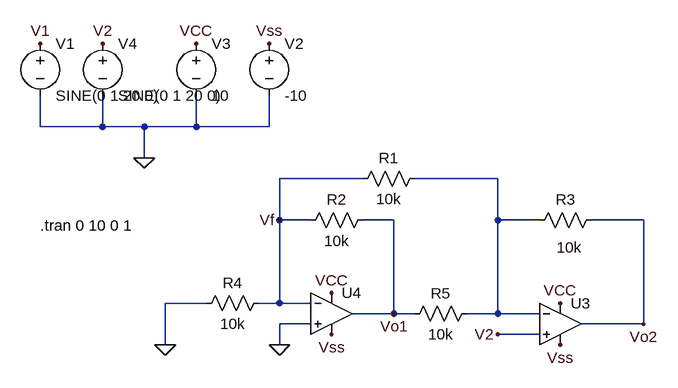
[diagram p0: schematic Laboratorio1-CircuitoI.asc]
Laboratorio1-CircuitoI.asc, the LTspice schematic file:
Version 4
SHEET 1 880 680
WIRE -688 -208 -688 -256
WIRE -592 -208 -592 -256
WIRE -592 -208 -688 -208
WIRE -528 -208 -592 -208
WIRE -448 -208 -448 -256
WIRE -448 -208 -528 -208
WIRE -336 -208 -336 -256
WIRE -336 -208 -448 -208
WIRE -528 -160 -528 -208
WIRE -192 -128 -320 -128
WIRE 16 -128 -112 -128
WIRE -320 -64 -320 -128
WIRE -272 -64 -320 -64
WIRE -144 -64 -192 -64
WIRE 16 -64 16 -128
WIRE 80 -64 16 -64
WIRE 240 -64 160 -64
WIRE -432 64 -496 64
WIRE -320 64 -320 -64
WIRE -320 64 -352 64
WIRE -272 64 -320 64
WIRE -144 80 -144 -64
WIRE -144 80 -208 80
WIRE -112 80 -144 80
WIRE 16 80 16 -64
WIRE 16 80 -32 80
WIRE 80 80 16 80
WIRE -272 96 -320 96
WIRE 240 96 240 -64
WIRE 240 96 144 96
WIRE 80 112 16 112
WIRE -496 128 -496 64
WIRE -320 128 -320 96
FLAG -496 128 0
FLAG -448 -336 VCC
FLAG -240 48 VCC
FLAG 112 64 VCC
FLAG -336 -336 Vss
FLAG -240 112 Vss
FLAG 112 128 Vss
FLAG -688 -336 V1
FLAG -592 -336 V2
FLAG -528 -160 0
FLAG -144 80 Vo1
FLAG 240 96 Vo2
FLAG -320 -64 Vf
FLAG 16 112 V2
FLAG -320 128 0
SYMBOL res -96 -144 R90
WINDOW 0 0 56 VBottom 2
WINDOW 3 32 56 VTop 2
SYMATTR InstName R1
SYMATTR Value 10k
SYMBOL res -176 -80 R90
WINDOW 0 0 56 VBottom 2
WINDOW 3 32 56 VTop 2
SYMATTR InstName R2
SYMATTR Value 10k
SYMBOL res 176 -80 R90
WINDOW 0 0 56 VBottom 2
WINDOW 3 42 50 VTop 2
SYMATTR InstName R3
SYMATTR Value 10k
SYMBOL res -336 48 R90
WINDOW 0 0 56 VBottom 2
WINDOW 3 32 56 VTop 2
SYMATTR InstName R4
SYMATTR Value 10k
SYMBOL res -16 64 R90
WINDOW 0 0 56 VBottom 2
WINDOW 3 32 56 VTop 2
SYMATTR InstName R5
SYMATTR Value 10k
SYMBOL voltage -688 -352 R0
WINDOW 123 0 0 Left 0
WINDOW 39 0 0 Left 0
SYMATTR InstName V1
SYMATTR Value SINE(0 1 20 0)
SYMBOL voltage -336 -352 R0
WINDOW 123 0 0 Left 0
WINDOW 39 0 0 Left 0
SYMATTR InstName V2
SYMATTR Value -10
SYMBOL voltage -448 -352 R0
WINDOW 123 0 0 Left 0
WINDOW 39 0 0 Left 0
SYMATTR InstName V3
SYMATTR Value 10
SYMBOL voltage -592 -352 R0
WINDOW 123 0 0 Left 0
WINDOW 39 0 0 Left 0
SYMATTR InstName V4
SYMATTR Value SINE(0 1 20 0)
SYMBOL OpAmps\\UniversalOpAmp 112 96 R0
SYMATTR InstName U3
SYMBOL OpAmps\\UniversalOpAmp1 -240 80 R0
SYMATTR InstName U4
TEXT -688 -56 Left 2 !.tran 0 10 0 1

The netlist it stands for:
* Laboratorio1-CircuitoI.asc
R1 N001 Vf 10k
R2 Vo1 Vf 10k
R3 Vo2 N001 10k
R4 Vf 0 10k
R5 N001 Vo1 10k
V1 V1 0 SINE(0 1 20 0)
V2 Vss 0 -10
V3 VCC 0 10
V4 V2 0 SINE(0 1 20 0)
XU3 V2 N001 VCC Vss Vo2 level1 Avol=1Meg GBW=10Meg Vos=0 En=0 Enk=0 In=0 Ink=0 Rin=500Meg  ; pins In+ In- V+ V- OUT
XU4 0 Vf VCC Vss Vo1 level1 Avol=1Meg GBW=10Meg Vos=0 En=0 Enk=0 In=0 Ink=0 Rin=500Meg  ; pins In+ In- V+ V- OUT
.tran 0 10 0 1
.lib UniversalOpAmp1.lib
.backanno
.end

* Results of the author's LTspice run, read from the files saved beside the schematic
* Operating Point, zero values left out:
*   V(vss) = -10 V
*   V(vcc) = 10 V
*   I(V3) = -40 nA
*   I(V2) = 40 nA
*   Ix(u3:3) = 20 nA
*   Ix(u3:4) = -20 nA
*   Ix(u4:3) = 20 nA
*   Ix(u4:4) = -20 nA
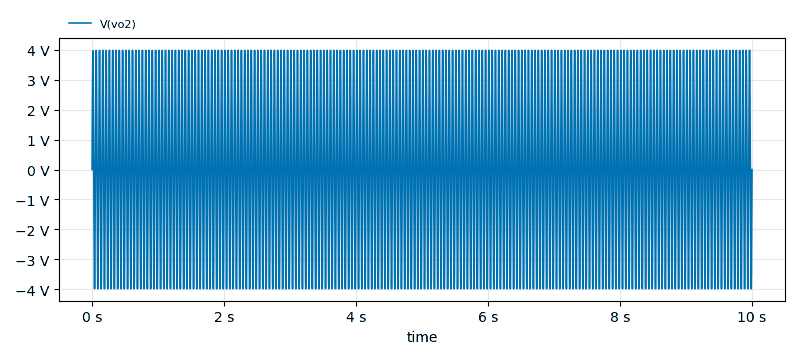
[diagram p1: Transient Analysis of Laboratorio1-CircuitoI.asc, plotted from the saved traces]
* Transient Analysis, 1 run:
*   V(vo2): min -3.987 V, max 3.987 V, average 7.25 µV, rms 2.823 V, last -38.26 µV